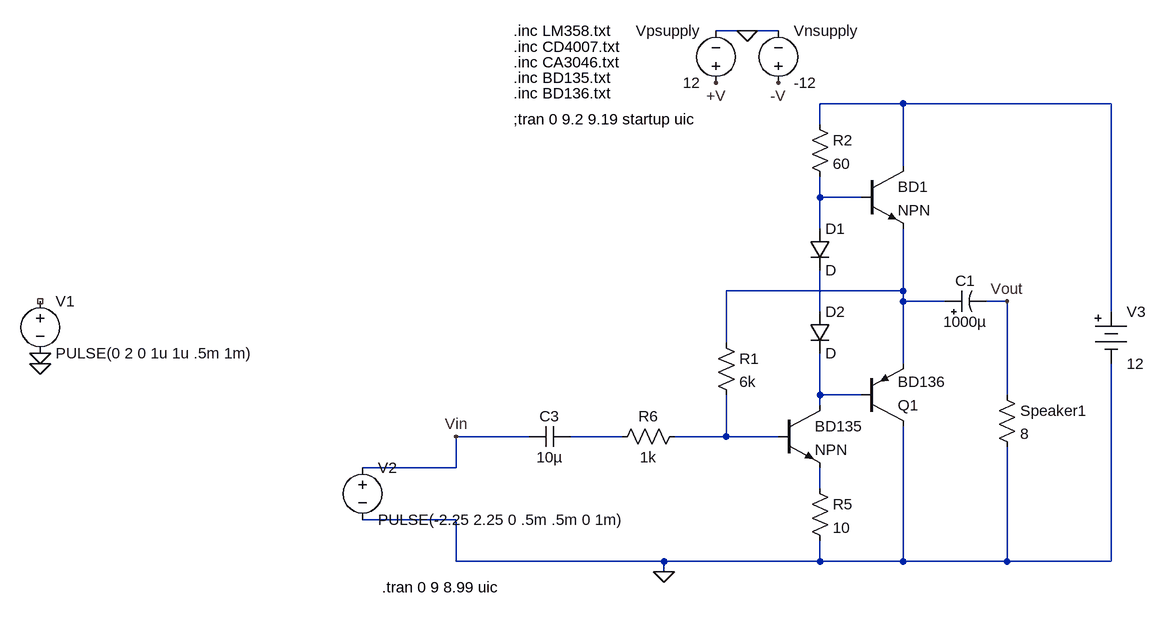
[diagram p0: schematic poweramp.asc]
poweramp.asc, the LTspice schematic file:
Version 4
SHEET 1 1144 1040
WIRE -352 16 -400 16
WIRE -304 16 -352 16
WIRE -112 128 -240 128
WIRE 208 128 -112 128
WIRE -240 160 -240 128
WIRE -112 224 -112 128
WIRE -240 272 -240 240
WIRE -176 272 -240 272
WIRE -240 320 -240 272
WIRE -112 416 -112 320
WIRE -112 416 -384 416
WIRE -112 432 -112 416
WIRE -48 432 -112 432
WIRE 48 432 16 432
WIRE -240 448 -240 384
WIRE 208 448 208 128
WIRE -384 496 -384 416
WIRE -112 528 -112 432
WIRE -240 576 -240 512
WIRE -176 576 -240 576
WIRE 48 576 48 432
WIRE -240 592 -240 576
WIRE -688 640 -800 640
WIRE -544 640 -624 640
WIRE -384 640 -384 576
WIRE -384 640 -464 640
WIRE -304 640 -384 640
WIRE -800 688 -800 640
WIRE -800 688 -944 688
WIRE -240 720 -240 688
WIRE -800 768 -944 768
WIRE -800 832 -800 768
WIRE -480 832 -800 832
WIRE -240 832 -240 800
WIRE -240 832 -480 832
WIRE -112 832 -112 624
WIRE -112 832 -240 832
WIRE 48 832 48 656
WIRE 48 832 -112 832
WIRE 208 832 208 528
WIRE 208 832 48 832
WIRE -480 848 -480 832
FLAG -352 16 0
FLAG -400 96 +V
FLAG -304 96 -V
FLAG -480 848 0
FLAG -800 640 Vin
FLAG 48 432 Vout
FLAG -1440 528 0
FLAG -1440 512 0
SYMBOL voltage -304 112 M180
WINDOW 0 24 96 Left 2
WINDOW 3 24 16 Left 2
WINDOW 123 0 0 Left 2
WINDOW 39 0 0 Left 2
SYMATTR InstName Vnsupply
SYMATTR Value -12
SYMBOL voltage -400 112 R180
WINDOW 0 24 96 Left 2
WINDOW 3 24 16 Left 2
WINDOW 123 0 0 Left 2
WINDOW 39 0 0 Left 2
SYMATTR InstName Vpsupply
SYMATTR Value 12
SYMBOL npn3 -304 592 R0
SYMATTR InstName BD135
SYMBOL res -400 480 R0
SYMATTR InstName R1
SYMATTR Value 6k
SYMBOL res -256 144 R0
SYMATTR InstName R2
SYMATTR Value 60
SYMBOL Misc\\battery 208 432 R0
WINDOW 123 0 0 Left 2
WINDOW 39 0 0 Left 2
SYMATTR InstName V3
SYMATTR Value 12
SYMBOL res 32 560 R0
SYMATTR InstName Speaker1
SYMATTR Value 8
SYMBOL Misc\\EuropeanPolcap -48 448 R270
WINDOW 0 32 32 VTop 2
WINDOW 3 0 32 VBottom 2
SYMATTR InstName C1
SYMATTR Value 1000µ
SYMBOL cap -624 624 R90
WINDOW 0 0 32 VBottom 2
WINDOW 3 32 32 VTop 2
SYMATTR InstName C3
SYMATTR Value 10µ
SYMBOL res -256 704 R0
SYMATTR InstName R5
SYMATTR Value 10
SYMBOL res -448 624 R90
WINDOW 0 0 56 VBottom 2
WINDOW 3 32 56 VTop 2
SYMATTR InstName R6
SYMATTR Value 1k
SYMBOL pnp -176 624 M180
SYMATTR InstName Q1
SYMATTR Value BD136
SYMBOL npn3 -176 224 R0
SYMATTR InstName BD1
SYMBOL diode -256 320 R0
SYMATTR InstName D1
SYMBOL diode -256 448 R0
SYMATTR InstName D2
SYMBOL voltage -1440 416 R0
WINDOW 123 0 0 Left 2
WINDOW 39 0 0 Left 2
SYMATTR InstName V1
SYMATTR Value PULSE(0 2 0 1u 1u .5m 1m)
SYMBOL voltage -944 672 R0
WINDOW 123 0 0 Left 2
WINDOW 39 0 0 Left 2
SYMATTR InstName V2
SYMATTR Value PULSE(-2.25 2.25 0 .5m .5m 0 1m)
TEXT -712 16 Left 2 !.inc LM358.txt
TEXT -712 40 Left 2 !.inc CD4007.txt
TEXT -712 64 Left 2 !.inc CA3046.txt
TEXT -712 152 Left 2 !;tran 0 9.2 9.19 startup uic
TEXT -712 88 Left 2 !.inc BD135.txt
TEXT -712 112 Left 2 !.inc BD136.txt
TEXT -914 872 Left 2 !.tran 0 9 8.99 uic

The netlist it stands for:
* poweramp.asc
Vnsupply -V 0 -12
Vpsupply +V 0 12
Q§BD135 N005 N007 N008 0 NPN
R1 N003 N007 6k
R2 N001 N002 60
V3 N001 0 12
R§Speaker1 Vout 0 8
C1 N003 Vout 1000µ
C3 N006 Vin 10µ
R5 N008 0 10
R6 N007 N006 1k
Q1 0 N005 N003 0 BD136
Q§BD1 N001 N002 N003 0 NPN
D1 N002 N004 D
D2 N004 N005 D
V1 NC_01 0 PULSE(0 2 0 1u 1u .5m 1m)
V2 Vin 0 PULSE(-2.25 2.25 0 .5m .5m 0 1m)
.model D D
.lib standard.dio
.model NPN NPN
.model PNP PNP
.lib standard.bjt
.inc LM358.txt
.inc CD4007.txt
.inc CA3046.txt
;tran 0 9.2 9.19 startup uic
.inc BD135.txt
.inc BD136.txt
.tran 0 9 8.99 uic
.backanno
.end